# EAGLE design arduino_basic_example (EAGLE 7.3.0)
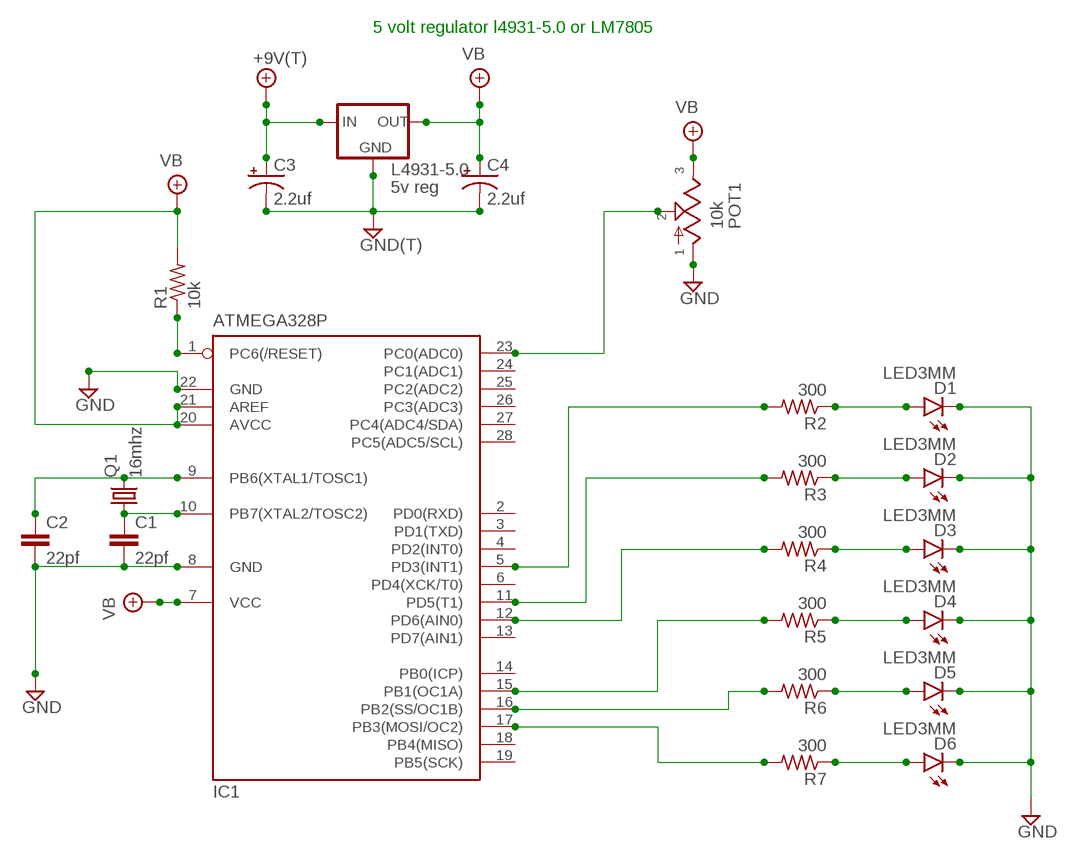
[diagram p0: schematic, sheet 1]

## Parts
+9V1  +9V(T)  [SQUARE]
C1  22pf  050X030_0251  [050X030_025]
C2  22pf  050X030_0251  [050X030_025]
C3  2.2uf  050  [050_020]
C4  2.2uf  050  [050_020]
D1  LED3MM  [LED3MM]
D2  LED3MM  [LED3MM]
D3  LED3MM  [LED3MM]
D4  LED3MM  [LED3MM]
D5  LED3MM  [LED3MM]
D6  LED3MM  [LED3MM]
GND1  GND(T)  [SQUARE]
IC1  ATMEGA328P  MEGA8-P  [DIL28-3]
L4931-5.0  5v reg  78LXX  [78LXX]
POT1  10k  POT16MM  [16MM]
Q1  16mhz  CRYSTALHC49S  [HC49/S]
R1  10k  6MM.3  [R0207/3]
R2  300  6MM.3  [R0207/3]
R3  300  6MM.3  [R0207/3]
R4  300  6MM.3  [R0207/3]
R5  300  6MM.3  [R0207/3]
R6  300  6MM.3  [R0207/3]
R7  300  6MM.3  [R0207/3]

## Nets
+9V: +9V1.1(+9V) C3.+ L4931-5.0.IN
GND: C1.2 C2.2 C3.- C4.- D1.K(C) D2.K(C) D3.K(C) D4.K(C) D5.K(C) D6.K(C) GND1.1(GND) IC1.8(GND) IC1.22(GND) L4931-5.0.GND POT1.1
N$1: IC1.5(PD3(INT1)) R2.2
N$2: C2.1 IC1.9(PB6(XTAL1/TOSC1)) Q1.2
N$3: C1.1 IC1.10(PB7(XTAL2/TOSC2)) Q1.1
N$4: IC1.11(PD5(T1)) R3.2
N$5: IC1.1(PC6(/RESET)) R1.1
N$6: IC1.12(PD6(AIN0)) R4.2
N$7: IC1.15(PB1(OC1A)) R5.2
N$8: D1.A R2.1
N$9: IC1.16(PB2(SS/OC1B)) R6.2
N$10: IC1.17(PB3(MOSI/OC2)) R7.2
N$11: D2.A R3.1
N$12: D3.A R4.1
N$13: D4.A R5.1
N$14: D5.A R6.1
N$15: D6.A R7.1
N$22: IC1.23(PC0(ADC0)) POT1.2
VB: C4.+ IC1.7(VCC) IC1.20(AVCC) IC1.21(AREF) L4931-5.0.OUT POT1.3 R1.2
Unconnected: IC1.2(PD0(RXD)) IC1.3(PD1(TXD)) IC1.4(PD2(INT0)) IC1.6(PD4(XCK/T0)) IC1.13(PD7(AIN1)) IC1.14(PB0(ICP)) IC1.18(PB4(MISO)) IC1.19(PB5(SCK)) IC1.24(PC1(ADC1)) IC1.25(PC2(ADC2)) IC1.26(PC3(ADC3)) IC1.27(PC4(ADC4/SDA)) IC1.28(PC5(ADC5/SCL))

## Notes on the sheet
- 5 volt regulator l4931-5.0 or LM7805

## Library data of the parts
+9V1 = gm-supply:+9V(T): +9V Voltage Supply use this to hook up +9v throughout a schematic instead of running wire automatically labels the net "+9v" adds a hookup pad to the circuit board
C1 C2 = gm-caps-ceramic:050X030_025: 47 - 120pF Xicon Ceramic Disc 2.5mm lead spacing
C3 C4 = gm-caps-electro-pol:050: 0.22 - 100uF Xicon values at Mouser.com: 10V: 10 - 100uF; 16V: 2.2 - 47uF; 25V: 0.47 - 47uF; 50V: 0.22 - 22uF
D1-D6 = gm-diodes:LED
GND1 = gm-supply:GND(T): Ground use this to hook up ground (GND) throughout a schematic instead of running wire automatically labels the net "GND" adds a hookup pad to the circuit board (you can use several)
IC1 = atmel:MEGA8-P: MICROCONTROLLER 8 Kbytes FLASH, 1 kbytes SRAM, 512 bytes EEPROM, USART, 4-channel 10 bit ADC, 2-channel 8 bit ADC Pin compatible with Atmega48, ATMega88, ATMega168 Source: avr.lbr; OC_FARNELL: unknown; OC_NEWARK: unknown
L4931-5.0 = v-reg-3:78LXX: VOLTAGE REGULATOR
POT1 = gm-pots:POT: Potentiometers the arrow indicates the clockwise motion of th wiper (lug 2) fully counter clockwise there is no resistance between lugs 1 and 2 fully clockwise the resistance between lugs 1 and 2 is the value of the pot
Q1 = adafruit:CRYSTAL: CRYSTAL; OC_FARNELL: 1667008; OC_NEWARK: unknown
R1-R7 = gm-resistors:6MM: 6mm Resistors Leads spaced 1-6 holes apart for 0.1" perfboard. Suitable for 1/4 watt resistors.

## Board
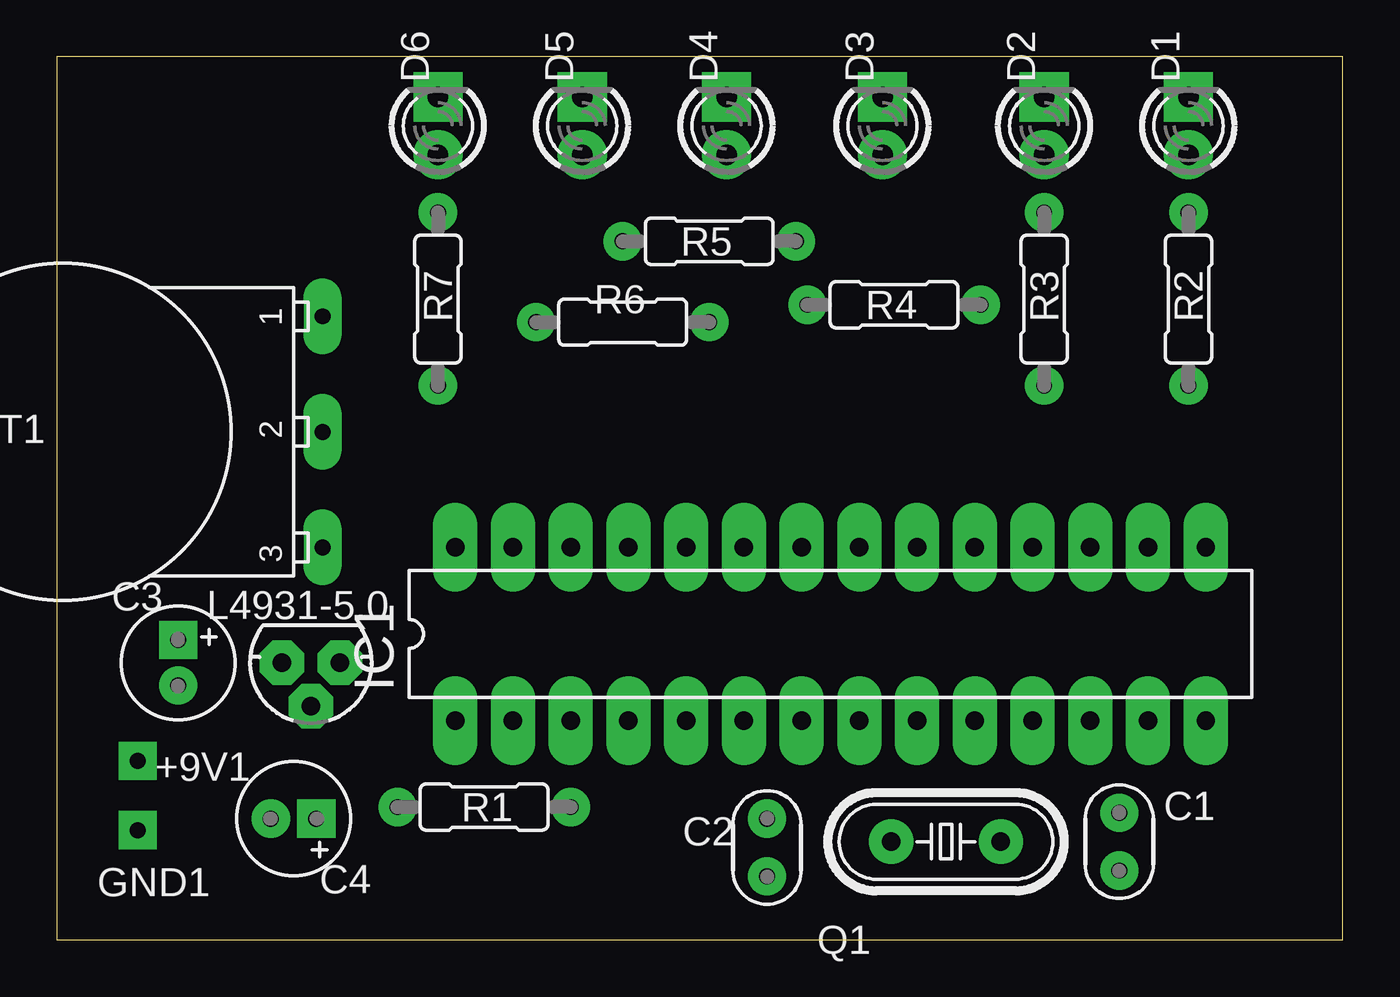
[diagram p1: board, top side]
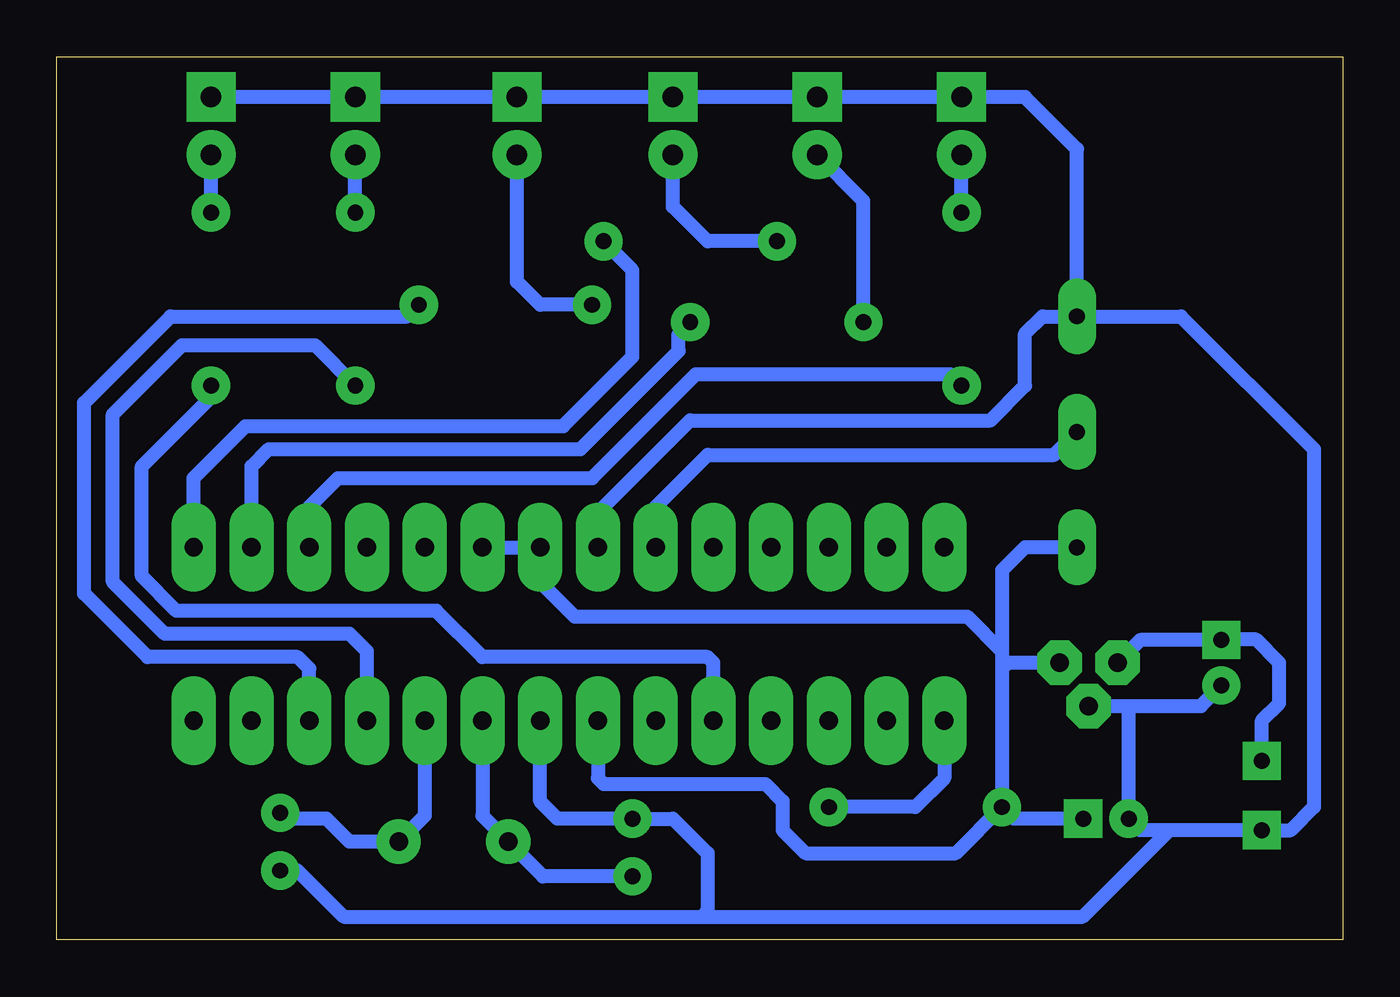
[diagram p2: board, bottom side, seen from below]

Size 56.57 x 38.85 mm. Coordinates in mm from the lower left corner, seen from the top.
Outline: 0,0 56.57,0 56.57,38.85 0,38.85 0,0
Copper layers (1*16): Top 0.035mm / dielectric 1.5mm / Bottom 0.035mm
Design rules "default *": minimum track width 10mil, minimum drill 24mil, track to track 8mil, track to pad 8mil, pad to pad 8mil, via to via 8mil, smd to smd 8mil, copper to edge 40mil, drill to drill 8mil, minimum pad ring 10mil, minimum via ring 8mil, stop-mask expansion 4mil, vias tented up to drill 0mil, thermal gap 10mil

### Footprints (pad centres in the part's own frame; a part is rotated, then mirrored left to right if it is on the bottom)
SQUARE = drill 0.7 square: 1 0,0
050X030_025 = drill 0.7: 1 -1.27,0; 2 1.27,0
050_020 = drill 0.7 square: + -1,0 | drill 0.7: - 1,0
LED3MM = drill 0.9: A -1.27,0 | drill 0.9 square: K 1.27,0
DIL28-3 = drill 0.813 long: 1 -16.51,-3.81; 2 -13.97,-3.81; 3 -11.43,-3.81; 4 -8.89,-3.81; 5 -6.35,-3.81; 6 -3.81,-3.81; 7 -1.27,-3.81; 8 1.27,-3.81; 9 3.81,-3.81; 10 6.35,-3.81; 11 8.89,-3.81; 12 11.43,-3.81; 13 13.97,-3.81; 14 16.51,-3.81; 15 16.51,3.81; 16 13.97,3.81; 17 11.43,3.81; 18 8.89,3.81; 19 6.35,3.81; 20 3.81,3.81; 21 1.27,3.81; 22 -1.27,3.81; 23 -3.81,3.81; 24 -6.35,3.81; 25 -8.89,3.81; 26 -11.43,3.81; 27 -13.97,3.81; 28 -16.51,3.81
78LXX = drill 0.813 octagon: GND 0,1.905; IN 1.27,0; OUT -1.27,0
16MM = drill 0.7 long: 1 5.08,0; 2 0,0; 3 -5.08,0
HC49/S = drill 0.813: 1 -2.413,0; 2 2.413,0
R0207/3 = drill 0.7: 1 -3.81,0; 2 3.81,0

### Placement (x,y rotation side)
+9V1  3.56,7.87 0 top
C1  46.74,4.32 270 top
C2  31.24,4.06 90 top
C3  5.33,12.19 270 top
C4  10.41,5.33 180 top
D1  49.78,35.81 90 top
D2  43.43,35.81 90 top
D3  36.32,35.81 90 top
D4  29.46,35.81 90 top
D5  23.11,35.81 90 top
D6  16.76,35.81 90 top
GND1  3.56,4.83 0 top
IC1  34.04,13.46 0 top
L4931-5.0  11.18,12.19 180 top
POT1  11.68,22.35 90 top
Q1  39.12,4.32 180 top
R1  18.8,5.84 180 top
R2  49.78,28.19 270 top
R3  43.43,28.19 270 top
R4  36.83,27.94 0 top
R5  28.7,30.73 0 top
R6  24.89,27.18 0 top
R7  16.76,28.19 270 top

### Tracks (layer width: path | path; a pad name or v marks a point on that pad's centre or on a via)
+9V
  Bottom 0.61: L4931-5.0.IN 8.91,13.19 C3.+ 5.32,13.21 3.81,13.21 2.79,12.19 2.79,10.41 3.56,9.65 +9V1.1
GND
  Bottom 0.61: D1.K D2.K D3.K D4.K D5.K D6.K 13.97,37.08 11.68,34.8 POT1.1 | IC1.8 35.31,6.1 34.54,5.33 C2.2 29.46,5.33 27.94,3.81 27.94,1.27 28.19,1.02 | IC1.22 32.77,18.8 28.7,22.86 15.49,22.86 13.97,24.38 13.97,26.67 13.21,27.43 POT1.1 | L4931-5.0.GND 9.4,10.29 | 9.4,10.29 6.24,10.29 C3.- | 9.4,10.29 9.41,10.27 C4.- 8.91,4.83 7.62,4.83 | 7.62,4.83 GND1.1 2.29,4.83 1.27,5.84 1.27,21.59 7.11,27.43 POT1.1 | C1.2 45.97,3.05 43.94,1.02 28.19,1.02 | 28.19,1.02 11.43,1.02 7.62,4.83
N$1
  Bottom 0.61: IC1.5 27.69,12.19 27.94,12.45 37.85,12.45 39.88,14.48 51.31,14.48 52.83,16 52.83,20.83 49.78,23.88 R2.2
N$2
  Bottom 0.61: IC1.9 37.85,5.46 Q1.2 35.18,2.79 C2.1
N$3
  Bottom 0.61: IC1.10 40.39,5.46 Q1.1 43.69,4.32 44.7,5.33 46.48,5.33 C1.1
N$4
  Bottom 0.61: IC1.11 42.93,12.7 43.69,13.46 51.82,13.46 54.1,15.75 54.1,23.11 51.05,26.16 45.21,26.16 R3.2
N$5
  Bottom 0.61: IC1.1 17.53,7.11 18.8,5.84 R1.1
N$6
  Bottom 0.61: IC1.12 45.47,11.94 45.97,12.45 52.58,12.45 55.37,15.24 55.37,23.62 51.56,27.43 41.15,27.43 R4.2
N$7
  Bottom 0.61: R5.2 31.24,29.46 31.24,25.65 34.29,22.61 48.26,22.61 50.55,20.32 IC1.15
N$8
  Bottom 0.61: R2.1 D1.A
N$9
  Bottom 0.61: IC1.16 48.01,20.83 47.24,21.59 33.53,21.59 29.21,25.91 29.21,26.67 R6.2
N$10
  Bottom 0.61: IC1.17 45.47,19.05 44.2,20.32 33.02,20.32 28.45,24.89 17.27,24.89 R7.2
N$11
  Bottom 0.61: R3.1 D2.A
N$12
  Bottom 0.61: R4.1 35.31,27.94 36.32,28.96 D3.A
N$13
  Bottom 0.61: R5.1 27.94,30.73 29.46,32.26 D4.A
N$14
  Bottom 0.61: R6.1 21.08,32.51 D5.A
N$15
  Bottom 0.61: R7.1 D6.A
N$22
  Bottom 0.61: IC1.23 30.23,19.05 27.94,21.34 12.7,21.34 POT1.2
VB
  Bottom 0.61: IC1.7 32.77,7.11 32.51,6.86 25.4,6.86 24.64,6.1 24.64,4.83 23.62,3.81 17.02,3.81 R1.2 | IC1.20 IC1.21 35.31,15.75 33.78,14.22 16.51,14.22 14.99,12.7 | 14.99,12.7 14.99,11.94 | 14.99,11.94 R1.2 | POT1.3 13.97,17.27 14.99,16.26 14.99,12.7 | L4931-5.0.OUT 14.73,12.19 14.99,11.94 | C4.+ 14.48,5.33 R1.2